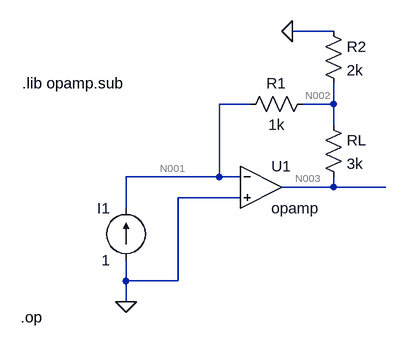
[diagram p0: schematic pag7es3.asc]
pag7es3.asc, the LTspice schematic file:
Version 4
SHEET 1 880 680
WIRE 352 -224 288 -224
WIRE 224 -112 176 -112
WIRE 352 -112 352 -144
WIRE 352 -112 304 -112
WIRE 352 -80 352 -112
WIRE 176 0 176 -112
WIRE 176 0 32 0
WIRE 208 0 176 0
WIRE 352 16 352 0
WIRE 352 16 272 16
WIRE 432 16 352 16
WIRE 208 32 112 32
WIRE 32 48 32 0
WIRE 32 160 32 128
WIRE 112 160 112 32
WIRE 112 160 32 160
WIRE 32 192 32 160
FLAG 32 192 0
FLAG 288 -224 0
SYMBOL current 32 128 R180
WINDOW 0 24 80 Left 2
WINDOW 3 24 0 Left 2
SYMATTR InstName I1
SYMATTR Value 1
SYMBOL OpAmps\\opamp 240 -48 R0
SYMATTR InstName U1
SYMBOL res 320 -128 R90
WINDOW 0 0 56 VBottom 2
WINDOW 3 32 56 VTop 2
SYMATTR InstName R1
SYMATTR Value 1k
SYMBOL res 336 -240 R0
SYMATTR InstName R2
SYMATTR Value 2k
SYMBOL res 336 -96 R0
SYMATTR InstName RL
SYMATTR Value 3k
TEXT -128 -144 Left 2 !.lib opamp.sub
TEXT -130 216 Left 2 !.op

The netlist it stands for:
* pag7es3.asc
I1 0 N001 1
XU1 N001 0 N003 opamp Aol=100K GBW=10Meg  ; pins invin noninvin out
R1 N002 N001 1k
R2 0 N002 2k
RL N002 N003 3k
.lib opamp.sub
.op
.backanno
.end

* Results of the author's LTspice run, read from the files saved beside the schematic
* Operating Point:
*   V(n001) = 55.01 mV
*   V(n003) = -5.5 kV
*   V(n002) = -999.9 V
*   I(I1) = 1 A
*   I(Rl) = 1.5 A
*   I(R2) = 500 mA
*   I(R1) = -1 A
*   Ix(u1:3) = 1.5 A